# Altium schematic sheet POW_Block.SchDoc
size A4; SheetNumber: 5; SheetTotal: 13
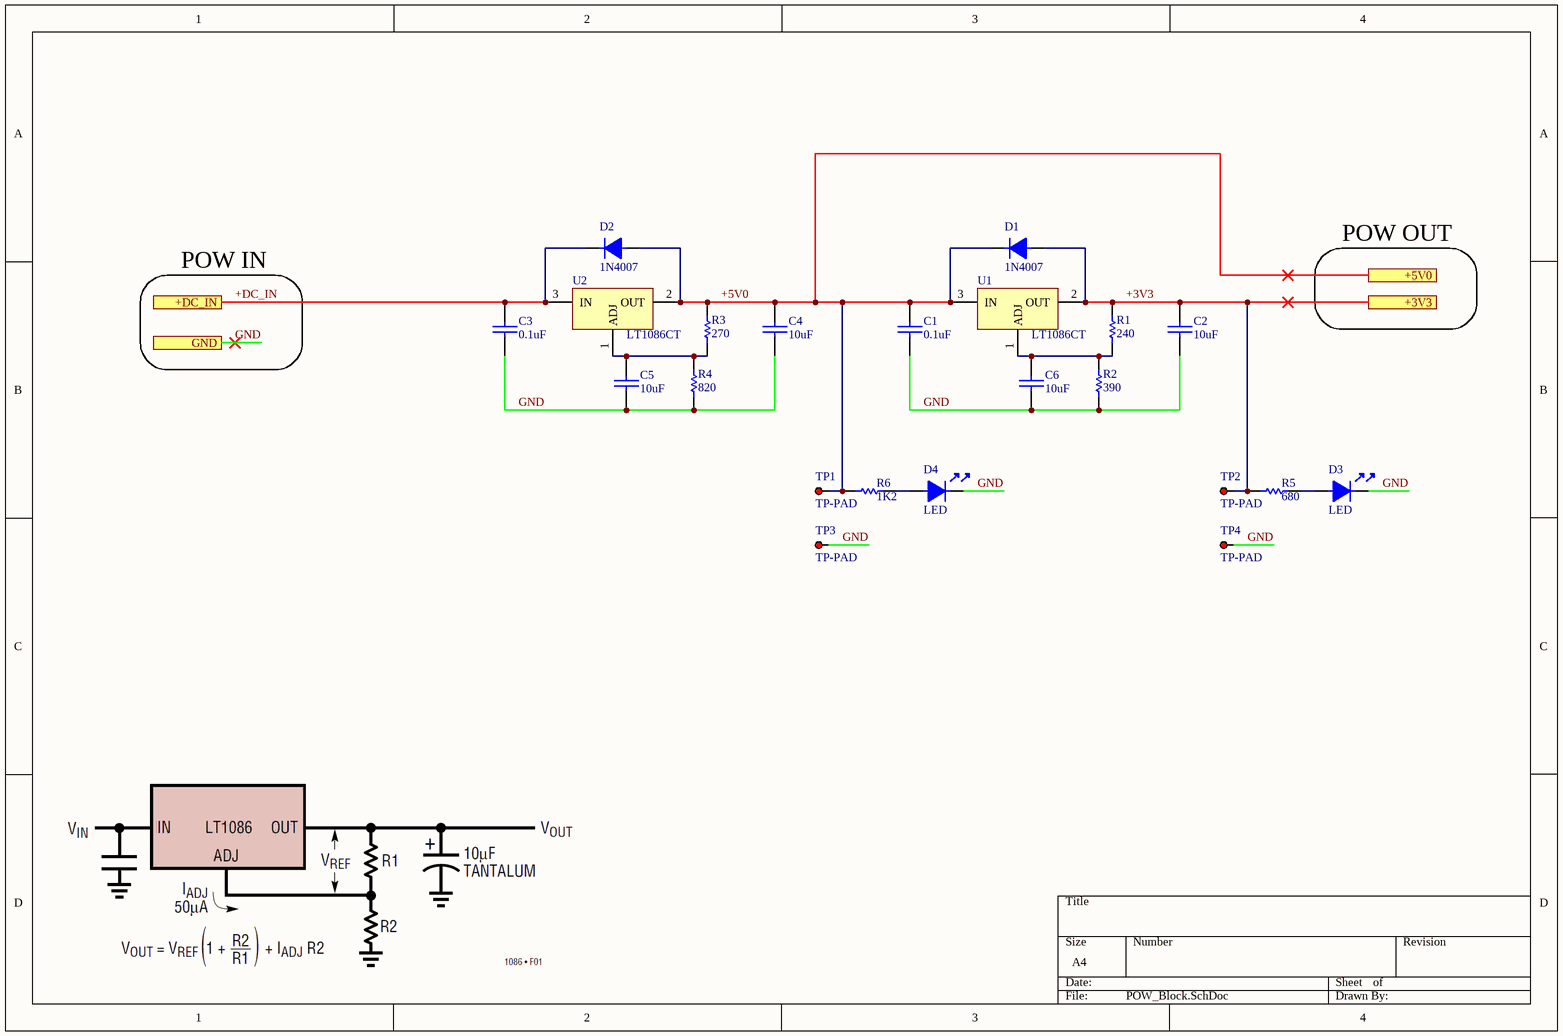
[diagram p0: POW_Block.SchDoc]

## Parts
C1  0.1uF  [0402-CAP-TDK]
C2  10uF  [0603-CAP-TDK]
C3  0.1uF  [0402-CAP-TDK]
C4  10uF  [0603-CAP-TDK]
C5  10uF  [0603-CAP-TDK]
C6  10uF  [0603-CAP-TDK]
D1  1N4007  [DO-214AC-SMA]
D2  1N4007  [DO-214AC-SMA]
D3  LED  [LED-0805]
D4  LED  [LED-0805]
R1  240  [0805-RES-PANASONIC]
R2  390  [0805-RES-PANASONIC]
R3  270  [0805-RES-PANASONIC]
R4  820  [0805-RES-PANASONIC]
R5  680  [0402-RES-PANASONIC]
R6  1K2  [0402-RES-PANASONIC]
TP1  TP-PAD  [TPTH - PAD TOP]  (no BOM)
TP2  TP-PAD  [TPTH - PAD TOP]  (no BOM)
TP3  TP-PAD  [TPTH - PAD TOP]  (no BOM)
TP4  TP-PAD  [TPTH - PAD TOP]  (no BOM)
U1  LT1086CT  [TO-220 - KCS0003B]
U2  LT1086CT  [TO-220 - KCS0003B]

## Ports
+3V3 (see AudioDSP-v2.0_top[2B], ADC_Block[1A], ADC_Interface[1B], CTRL_Connectors[1A], DAC_Block[1B], DSP_Block[1A], MCU_Block[1A], PLL_Block[1A]), +5V0 (see AudioDSP-v2.0_top[2B], DAC_Block[1B], LPF_Block[1B], LPF_Interface[1B]), +DC_IN (see AudioDSP-v2.0_top[2B], IN_Connectors[3A]), GND (see AudioDSP-v2.0_top[2B], ADC_Block[1B], ADC_Interface[1B], CTRL_Connectors[1A], DAC_Block[1B], DSP_Block[1B], IN_Connectors[3A], LPF_Block[1B], LPF_Interface[1B], MCU_Block[1B], OUT_Connectors[3B], PLL_Block[1A])

## Nets
+3V3: C2.2 D1.1 R1.2 R5.1 TP2.1 U1.2(OUT) ; port +3V3
+5V0: C1.2 C4.2 D1.2 D2.1 R3.2 R6.1 TP1.1 U1.3(IN) U2.2(OUT) ; port +5V0
+DC_IN: C3.2 D2.2 U2.3(IN) ; port +DC_IN
GND: C1.1 C2.1 C3.1 C4.1 C5.1 C6.1 D3.2 D4.2 R2.1 R4.1 TP3.1 TP4.1 ; port GND
NetC5_2: C5.2 R3.1 R4.2 U2.1(ADJ)
NetC6_2: C6.2 R1.1 R2.2 U1.1(ADJ)
NetD3_1: D3.1 R5.2
NetD4_1: D4.1 R6.2

## Notes on the sheet
- POW OUT
- POW IN

## Library data of the parts
C1-C6 = CAP-SMD
D1 D2 = 1N4007: Diode Rectifier 1A 1kV
D3 D4 = LED-SMD
R1-R6 = RES-SMD